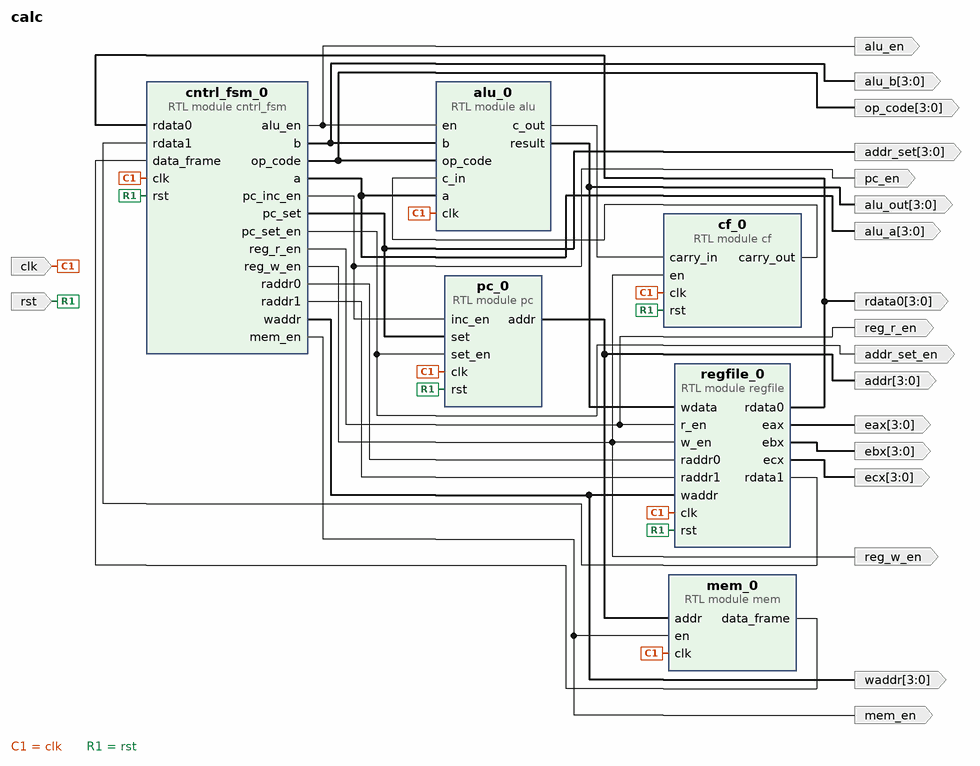
[diagram p0: block diagram of the top level]
# Vivado block design calc, xc7k70tfbv676-1, Vivado 2018.2.2
create_bd_design calc

create_bd_port -dir I -type clk clk
set_property -dict {CONFIG.FREQ_HZ 50000000} [get_bd_ports clk]
create_bd_port -dir I -type rst rst
set_property -dict {CONFIG.POLARITY ACTIVE_HIGH} [get_bd_ports rst]
create_bd_port -dir O mem_en
create_bd_port -dir O alu_en
create_bd_port -dir O -from 3 -to 0 op_code
create_bd_port -dir O -from 3 -to 0 alu_b
create_bd_port -dir O reg_r_en
create_bd_port -dir O -from 3 -to 0 alu_a
create_bd_port -dir O -from 3 -to 0 rdata0
create_bd_port -dir O pc_en
create_bd_port -dir O -from 3 -to 0 eax
create_bd_port -dir O -from 3 -to 0 ebx
create_bd_port -dir O -from 3 -to 0 ecx
create_bd_port -dir O -from 3 -to 0 addr
create_bd_port -dir O -from 3 -to 0 alu_out
create_bd_port -dir O -from 3 -to 0 waddr
create_bd_port -dir O reg_w_en
create_bd_port -dir O -from 3 -to 0 addr_set
create_bd_port -dir O addr_set_en

create_bd_cell -type module -reference cf cf_0
create_bd_cell -type module -reference alu alu_0
create_bd_cell -type module -reference pc pc_0
create_bd_cell -type module -reference mem mem_0
create_bd_cell -type module -reference cntrl_fsm cntrl_fsm_0
create_bd_cell -type module -reference regfile regfile_0

# ---- connections ----

connect_bd_net [get_bd_ports clk] \
  [get_bd_pins cf_0/clk] [get_bd_pins alu_0/clk] [get_bd_pins pc_0/clk] [get_bd_pins mem_0/clk] [get_bd_pins cntrl_fsm_0/clk] \
  [get_bd_pins regfile_0/clk]
connect_bd_net [get_bd_ports rst] [get_bd_pins cf_0/rst] [get_bd_pins pc_0/rst] [get_bd_pins cntrl_fsm_0/rst] [get_bd_pins regfile_0/rst]
connect_bd_net [get_bd_pins cntrl_fsm_0/mem_en] [get_bd_ports mem_en] [get_bd_pins mem_0/en]
connect_bd_net [get_bd_pins cntrl_fsm_0/alu_en] [get_bd_ports alu_en] [get_bd_pins alu_0/en]
connect_bd_net [get_bd_pins cntrl_fsm_0/op_code] [get_bd_ports op_code] [get_bd_pins alu_0/op_code]
connect_bd_net [get_bd_pins cntrl_fsm_0/b] [get_bd_ports alu_b] [get_bd_pins alu_0/b]
connect_bd_net [get_bd_pins cntrl_fsm_0/reg_r_en] [get_bd_ports reg_r_en] [get_bd_pins regfile_0/r_en]
connect_bd_net [get_bd_pins mem_0/data_frame] [get_bd_pins cntrl_fsm_0/data_frame]
connect_bd_net -net regfile_0_rdata [get_bd_pins cntrl_fsm_0/a] [get_bd_ports alu_a] [get_bd_pins alu_0/a]
connect_bd_net [get_bd_pins regfile_0/rdata0] [get_bd_ports rdata0] [get_bd_pins cntrl_fsm_0/rdata0]
connect_bd_net [get_bd_pins regfile_0/rdata1] [get_bd_pins cntrl_fsm_0/rdata1]
connect_bd_net [get_bd_pins cntrl_fsm_0/raddr0] [get_bd_pins regfile_0/raddr0]
connect_bd_net [get_bd_pins cntrl_fsm_0/raddr1] [get_bd_pins regfile_0/raddr1]
connect_bd_net -net cntrl_fsm_0_pc_en [get_bd_pins cntrl_fsm_0/pc_inc_en] [get_bd_ports pc_en] [get_bd_pins pc_0/inc_en]
connect_bd_net [get_bd_pins cf_0/carry_out] [get_bd_pins alu_0/c_in]
connect_bd_net [get_bd_pins alu_0/c_out] [get_bd_pins cf_0/carry_in]
connect_bd_net [get_bd_pins regfile_0/eax] [get_bd_ports eax]
connect_bd_net [get_bd_pins regfile_0/ebx] [get_bd_ports ebx]
connect_bd_net [get_bd_pins regfile_0/ecx] [get_bd_ports ecx]
connect_bd_net [get_bd_pins pc_0/addr] [get_bd_ports addr] [get_bd_pins mem_0/addr]
connect_bd_net [get_bd_pins alu_0/result] [get_bd_ports alu_out] [get_bd_pins regfile_0/wdata]
connect_bd_net [get_bd_pins cntrl_fsm_0/waddr] [get_bd_ports waddr] [get_bd_pins regfile_0/waddr]
connect_bd_net [get_bd_pins cntrl_fsm_0/reg_w_en] [get_bd_ports reg_w_en] [get_bd_pins cf_0/en] [get_bd_pins regfile_0/w_en]
connect_bd_net [get_bd_pins cntrl_fsm_0/pc_set] [get_bd_ports addr_set] [get_bd_pins pc_0/set]
connect_bd_net [get_bd_pins cntrl_fsm_0/pc_set_en] [get_bd_ports addr_set_en] [get_bd_pins pc_0/set_en]

validate_bd_design
save_bd_design
